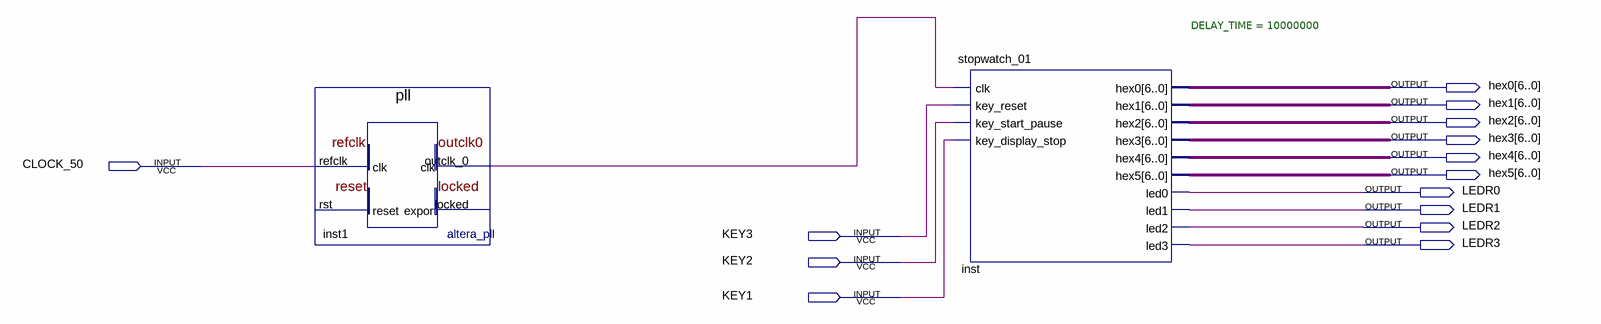
[diagram p0: schematic sheet]
// Quartus schematic stop_watch.bdf as structural Verilog: 2 symbols, 14 pins
module stop_watch (
  input  CLOCK_50,
  input  KEY3,
  input  KEY2,
  input  KEY1,
  output [6:0] hex0,
  output [6:0] hex1,
  output [6:0] hex2,
  output [6:0] hex3,
  output [6:0] hex4,
  output [6:0] hex5,
  output LEDR0,
  output LEDR1,
  output LEDR2,
  output LEDR3
);

  wire inst1_outclk_0;

  pll inst1 (.refclk(CLOCK_50), .outclk_0(inst1_outclk_0));  // open: rst, locked
  stopwatch_01 #(.DELAY_TIME(10000000)) inst (
    .clk(inst1_outclk_0), .key_reset(KEY3), .key_start_pause(KEY2), .key_display_stop(KEY1), .hex0(hex0),
    .hex1(hex1), .hex2(hex2), .hex3(hex3), .hex4(hex4), .hex5(hex5), .led0(LEDR0), .led1(LEDR1),
    .led2(LEDR2), .led3(LEDR3));
endmodule
